# EAGLE design SSM_RGB (EAGLE 8.4.3)
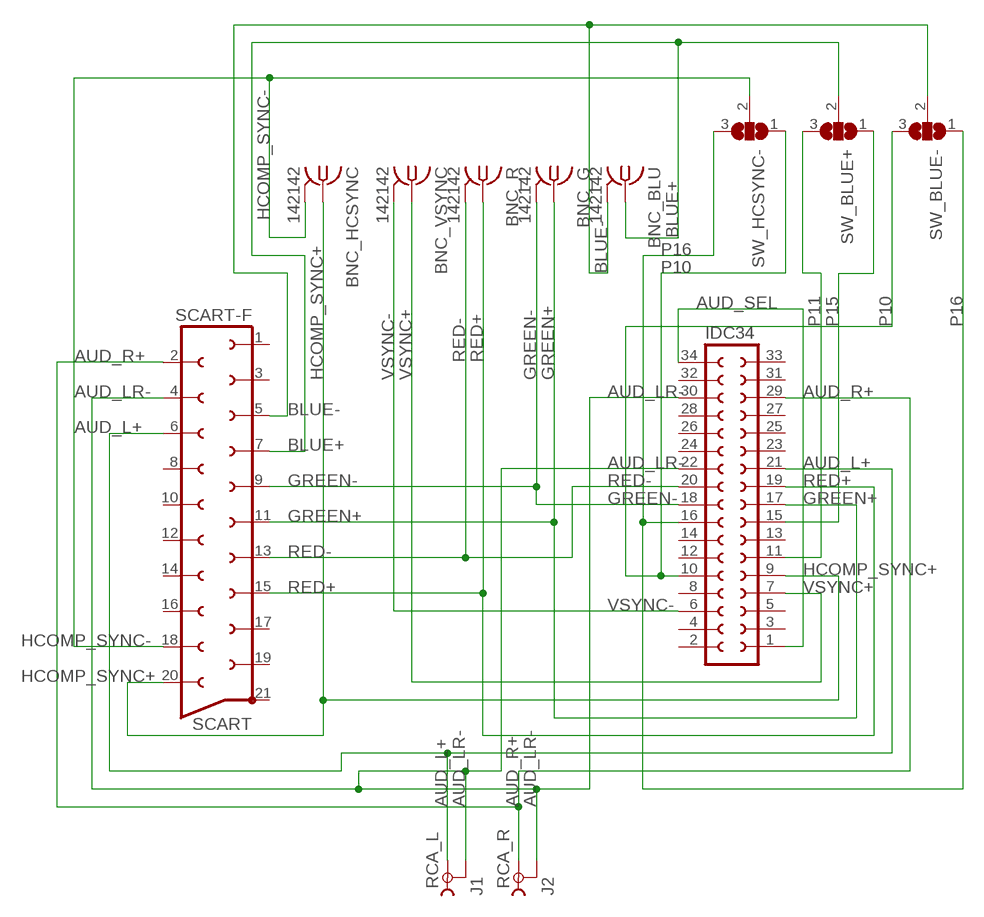
[diagram p0: schematic, sheet 1]

## Parts
BNC_BLU  142142  [142142]
BNC_G  142142  [142142]
BNC_HCSYNC  142142  [142142]
BNC_R  142142  [142142]
BNC_VSYNC  142142  [142142]
IDC34  SOCKET-34RA  [S34RA]
RCA_L  J1  TOBU3  [TOBU3]
RCA_R  J2  TOBU3  [TOBU3]
SCART  SCART-F  [SCART-F]
SW_BLUE+  SJ2W  [SJ_2]
SW_BLUE-  SJ2W  [SJ_2]
SW_HCSYNC-  SJ2W  [SJ_2]

## Nets
AUD_L+: IDC34.21 RCA_L.1 SCART.6
AUD_LR-: IDC34.22 IDC34.30 RCA_L.2 RCA_L.2@1 RCA_L.2@2 RCA_R.2 RCA_R.2@1 RCA_R.2@2 SCART.4
AUD_R+: IDC34.29 RCA_R.1 SCART.2
AUD_SEL: IDC34.1 IDC34.34
BLUE+: BNC_BLU.1 SCART.7 SW_BLUE+.2
BLUE-: BNC_BLU.2 BNC_BLU.3 BNC_BLU.4 BNC_BLU.5 SCART.5 SW_BLUE-.2
GREEN+: BNC_G.1 IDC34.17 SCART.11
GREEN-: BNC_G.2 BNC_G.3 BNC_G.4 BNC_G.5 IDC34.18 SCART.9
HCOMP_SYNC+: BNC_HCSYNC.1 IDC34.9 SCART.20
HCOMP_SYNC-: BNC_HCSYNC.2 BNC_HCSYNC.3 BNC_HCSYNC.4 BNC_HCSYNC.5 SCART.18 SW_HCSYNC-.2
P10: IDC34.10 SW_BLUE-.3 SW_HCSYNC-.1
P11: IDC34.11 SW_BLUE+.3
P15: IDC34.15 SW_BLUE+.1
P16: IDC34.16 SW_BLUE-.1 SW_HCSYNC-.3
RED+: BNC_R.1 IDC34.19 SCART.15
RED-: BNC_R.2 BNC_R.3 BNC_R.4 BNC_R.5 IDC34.20 SCART.13
VSYNC+: BNC_VSYNC.1 IDC34.7
VSYNC-: BNC_VSYNC.2 BNC_VSYNC.3 BNC_VSYNC.4 BNC_VSYNC.5 IDC34.6
Unconnected: IDC34.2 IDC34.3 IDC34.4 IDC34.5 IDC34.8 IDC34.12 IDC34.13 IDC34.14 IDC34.23 IDC34.24 IDC34.25 IDC34.26 IDC34.27 IDC34.28 IDC34.31 IDC34.32 IDC34.33 SCART.1 SCART.3 SCART.8 SCART.10 SCART.12 SCART.14 SCART.16 SCART.17 SCART.19 SCART.21

## Library data of the parts
BNC_BLU BNC_G BNC_R BNC_VSYNC = amphenol-142142_10:142142: Amphenol Connex 142142 SMB R/A P. C. B. Mount Plug Source: http://www.amphenolconnex.com/media/downloads/4323/142142.pdf; MF: Amphenol Connex; MPN: 142142; OC_FARNELL: unknown; OC_NEWARK: unknown
BNC_HCSYNC = amphenol-142142_10:142142: Amphenol Connex 142142 SMB R/A P. C. B. Mount Plug Source: http://www.amphenolconnex.com/media/downloads/4323/142142.pdf; MF: Amphenol Connex; OC_FARNELL: unknown; OC_NEWARK: unknown
IDC34 = con-3m-skt-header:SOCKET-34: 34 pin PCB Socket (3m 85xx/51xx)
RCA_L RCA_R = con-hirschmann:TOBU3: Female Cinch CONNECTOR ( RCA Jack ); MF: FARNELL; MPN: TOBU 3; OC_FARNELL: 592791; OC_NEWARK: 06WX5914
SCART = con-hirschmann:SCART-F: TV SCART CONNECTOR; OC_FARNELL: unknown; OC_NEWARK: unknown
SW_BLUE+ SW_BLUE- SW_HCSYNC- = jumper:SJ2W: SMD solder JUMPER

## Board
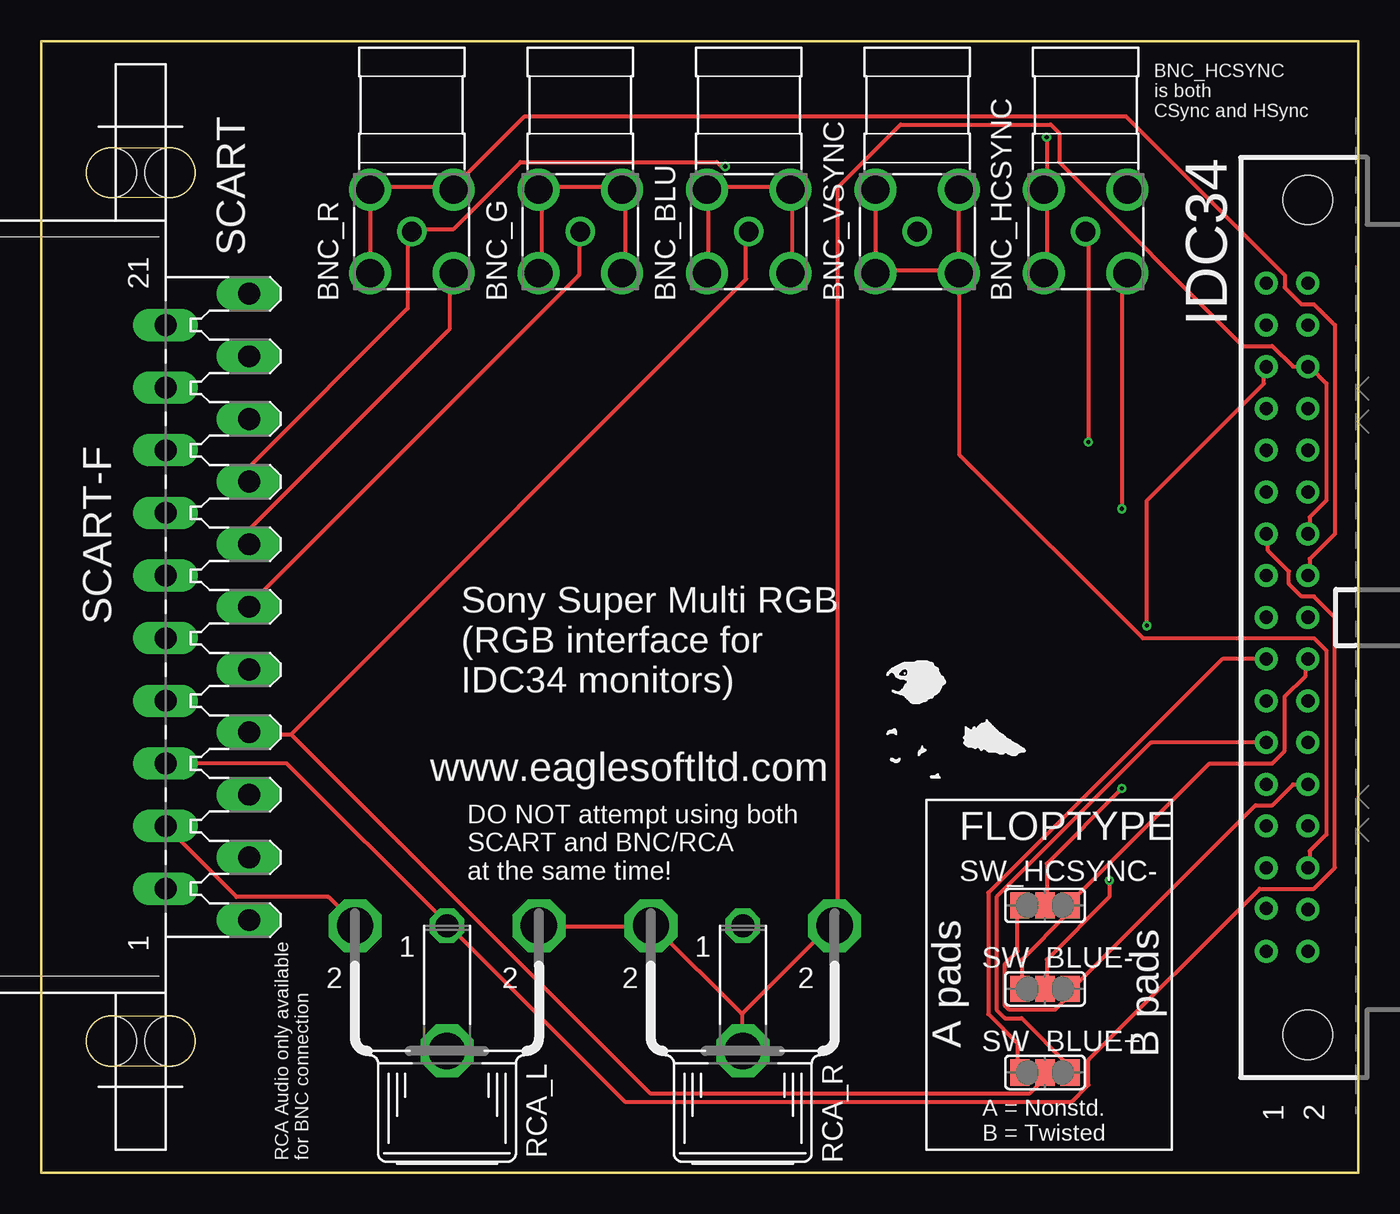
[diagram p1: board, top side]
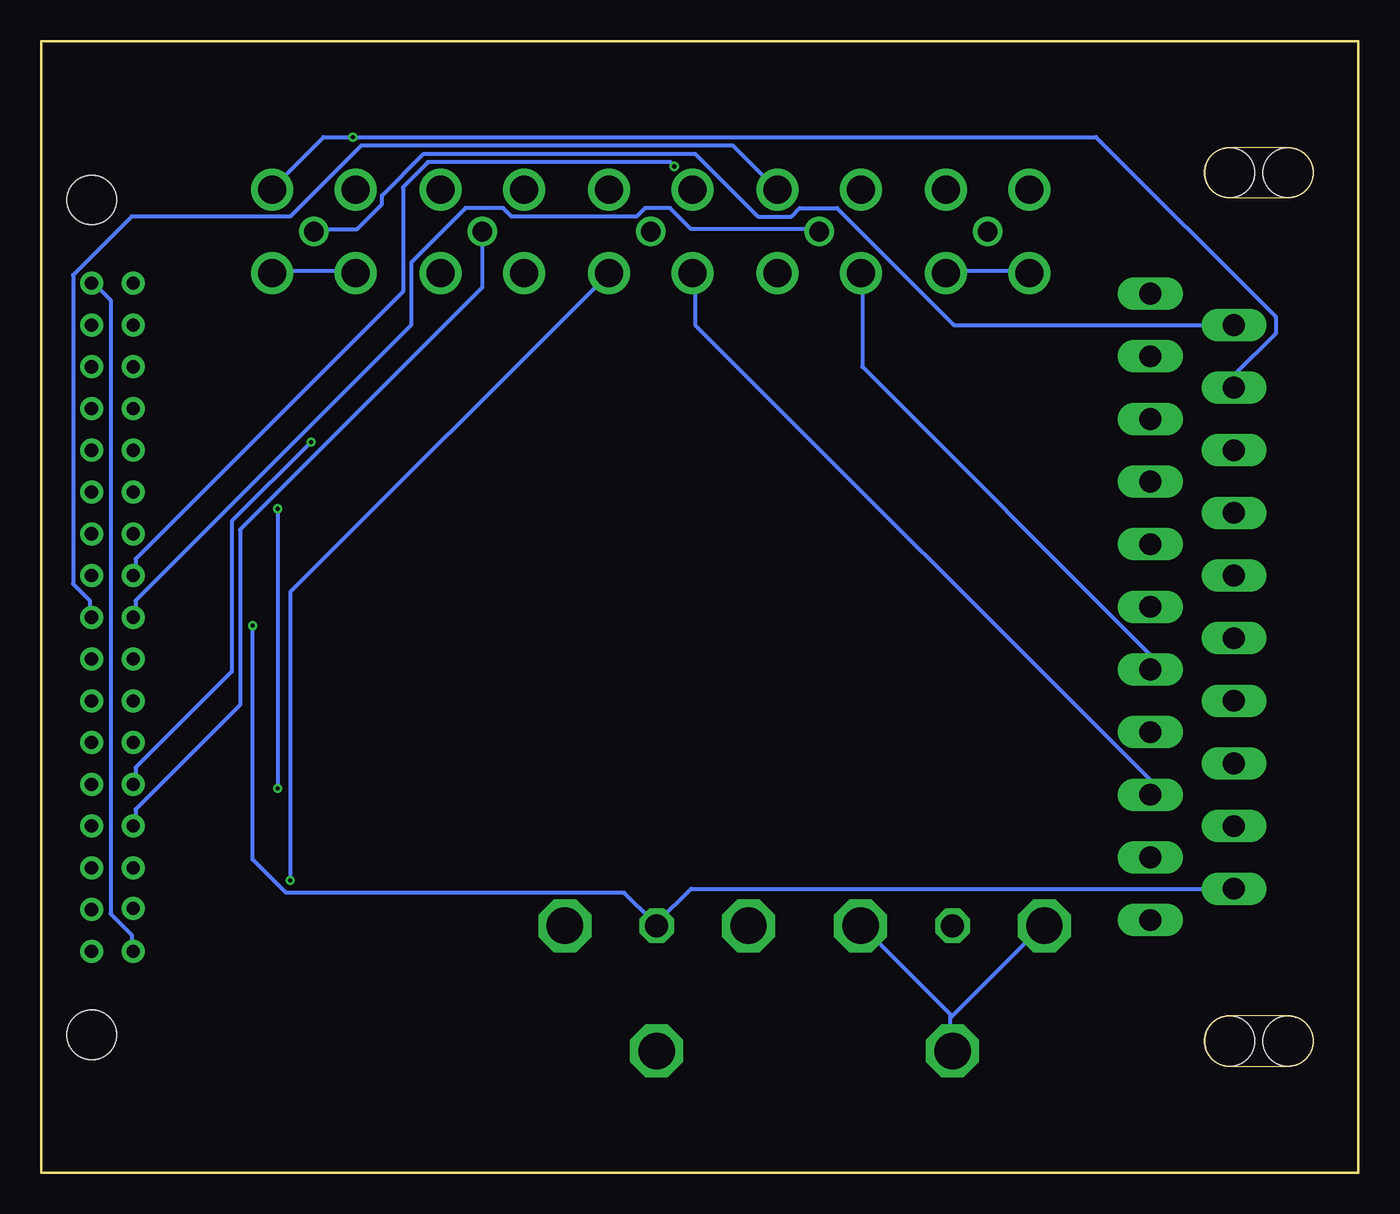
[diagram p2: board, bottom side, seen from below]

Size 80.13 x 68.83 mm. Coordinates in mm from the lower left corner, seen from the top.
Outline: 80.13,68.83 80.13,0 0,0 0,68.83 80.13,68.83
Copper layers (1*16): Top 0.035559375mm / dielectric 1.6mm / Bottom 0.035559375mm
Design rules "oshpark-2layer-auto-routing": minimum track width 10mil, minimum drill 10mil, track to track 10mil, track to pad 8mil, pad to pad 8mil, via to via 8mil, smd to smd 6mil, copper to edge 15mil, drill to drill 6mil, minimum pad ring 6mil, minimum via ring 6mil, stop-mask expansion 2.5mil, vias tented up to drill 0mil, thermal gap 10mil

### Footprints (pad centres in the part's own frame; a part is rotated, then mirrored left to right if it is on the bottom)
142142 = drill 1.2: 1 0,0 | drill 1.7: 2 -2.54,2.54; 3 2.54,2.54; 4 2.54,-2.54; 5 -2.54,-2.54
S34RA = drill 0.8 pad 1.4: 1 20.32,-5.44; 2 20.32,-2.9; 3 17.7,-5.44; 4 17.78,-2.9; 5 15.24,-5.44; 6 15.24,-2.9; 7 12.7,-5.44; 8 12.7,-2.9; 9 10.16,-5.44; 10 10.16,-2.9; 11 7.62,-5.44; 12 7.62,-2.9; 13 5.08,-5.44; 14 5.08,-2.9; 15 2.54,-5.44; 16 2.54,-2.9; 17 0,-5.44; 18 0,-2.9; 19 -2.54,-5.44; 20 -2.54,-2.9; 21 -5.08,-5.44; 22 -5.08,-2.9; 23 -7.62,-5.44; 24 -7.62,-2.9; 25 -10.16,-5.44; 26 -10.16,-2.9; 27 -12.7,-5.44; 28 -12.7,-2.9; 29 -15.24,-5.44; 30 -15.24,-2.9; 31 -17.78,-5.44; 32 -17.78,-2.9; 33 -20.32,-5.44; 34 -20.32,-2.9 | hole 3: -25.39,-2.9; 25.39,-2.9
TOBU3 = drill 1.397 octagon: 1 0,-2.54 | drill 2.21 octagon: 2 5.588,-2.54; 2@1 -5.588,-2.54; 2@2 0,5.08
SCART-F = drill 1.321 long: 1 19.05,5.08; 2 17.145,0; 3 15.24,5.08; 4 13.335,0; 5 11.43,5.08; 6 9.525,0; 7 7.62,5.08; 8 5.715,0; 9 3.81,5.08; 10 1.905,0; 11 0,5.08; 12 -1.905,0; 13 -3.81,5.08; 14 -5.715,0; 15 -7.62,5.08; 16 -9.525,0; 17 -11.43,5.08; 18 -13.335,0; 19 -15.24,5.08; 20 -17.145,0; 21 -19.05,5.08 | hole 3.023: 26.416,0.254; 26.416,-3.302; -26.416,0.254; -26.416,-3.302
SJ_2 = smd 1.168 x 1.6: 1 -1.524,0; 2 0,0; 3 1.524,0

### Placement (x,y rotation side)
BNC_BLU  43.05,57.25 90 top
BNC_G  32.8,57.25 90 top
BNC_HCSYNC  63.54,57.25 90 top
BNC_R  22.55,57.25 90 top
BNC_VSYNC  53.3,57.25 90 top
IDC34  79.97,33.78 270 top
RCA_L  24.69,12.48 180 top
RCA_R  42.68,12.48 180 top
SCART  7.58,34.42 270 top
SW_BLUE+  61.07,6.1 0 top
SW_BLUE-  61.07,11.18 0 top
SW_HCSYNC-  61.07,16.26 0 top

### Tracks (layer width: path | path; a pad name or v marks a point on that pad's centre or on a via)
AUD_L+
  Top 0.254: IDC34.21 74.63,38.86 74.63,37.85 75.9,36.58 75.9,35.81 76.66,35.05 77.43,35.05 78.7,33.78 78.7,18.54 77.43,17.27 74.12,17.27 63.71,6.86 63.71,5.33 62.69,4.32 35.52,4.32 24.85,14.99 RCA_L.1 24.59,15.24 14.94,24.89 SCART.6
AUD_LR-
  Top 0.254: SCART.4 11.89,16.76 17.48,16.76 19.01,15.24 RCA_L.2 | RCA_L.2@1 30.44,14.99 37.04,14.99 RCA_R.2 37.29,14.99 42.63,9.65 | 42.63,9.65 42.63,7.62 RCA_R.2@2 | IDC34.22 77.17,38.86 77.17,39.88 78.19,40.89 78.19,48.01 77.17,49.02 IDC34.30 76.16,49.02 74.89,50.29 73.11,50.29 61.93,61.47 61.93,63.25 61.42,63.75 52.28,63.75 48.47,59.94 48.47,15.24 RCA_R.2@1 48.22,15.24 42.63,9.65
  Bottom 0.254: 24.85,9.4 24.85,9.65 30.18,14.99 RCA_L.2@1 | 24.85,9.4 24.85,7.62 RCA_L.2@2 | 24.85,9.4 19.26,14.99 RCA_L.2
AUD_R+  (via drill 0.25)
  Top 0.254: v67.27,33.27 67.27,40.89 74.38,48.01 74.38,49.02 IDC34.29
  Bottom 0.254: v67.27,33.27 67.27,19.05 65.23,17.02 44.66,17.02 42.88,15.24 RCA_R.1 42.63,15.24 40.6,17.27 SCART.2
AUD_SEL
  Bottom 0.254: IDC34.1 74.63,13.46 74.63,14.48 75.9,15.75 75.9,53.09 76.92,54.1 IDC34.34
BLUE+
  Top 0.254: 15.2,26.67 37.04,4.83 60.15,4.83 60.92,5.59 60.92,6.1 SW_BLUE+.2 | 15.2,26.67 12.66,26.67 SCART.7 | 15.2,26.67 42.88,54.36 42.88,57.15 BNC_BLU.1
BLUE-  (via drill 0.25)
  Top 0.254: v64.98,17.78 64.98,16.76 61.17,12.95 61.17,11.18 SW_BLUE-.2 | BNC_BLU.2 40.6,54.86 40.6,59.69 BNC_BLU.3 40.6,59.94 45.42,59.94 BNC_BLU.4 45.68,59.69 45.68,54.86 BNC_BLU.5
  Bottom 0.254: v64.98,17.78 64.98,35.31 45.68,54.61 BNC_BLU.5 | SCART.5 12.66,23.88 40.34,51.56 40.34,54.61 BNC_BLU.2
GREEN+
  Top 0.254: SCART.11 12.66,34.54 32.72,54.61 32.72,57.15 BNC_G.1
  Bottom 0.254: IDC34.17 74.38,33.78 74.38,34.8 57.61,51.56 57.61,55.37 54.31,58.67 52.03,58.67 51.52,58.17 43.9,58.17 43.39,58.67 41.87,58.67 40.6,57.4 32.98,57.4 BNC_G.1
GREEN-
  Top 0.254: BNC_G.5 35.52,54.86 35.52,59.69 BNC_G.4 35.26,59.94 30.44,59.94 BNC_G.3 30.44,59.69 30.44,54.86 BNC_G.2
  Bottom 0.254: SCART.9 12.66,31.5 30.18,49.02 30.18,54.61 BNC_G.2 | IDC34.18 77.17,33.78 77.17,34.8 78.19,35.81 78.19,54.61 74.63,58.17 64.98,58.17 60.66,62.48 38.06,62.48 35.52,59.94 BNC_G.4
HCOMP_SYNC+  (via drill 0.25)
  Top 0.254: v63.71,44.45 63.71,57.15 BNC_HCSYNC.1
  Bottom 0.254: v63.71,44.45 68.54,39.62 68.54,30.48 74.38,24.64 74.38,23.62 IDC34.9 | SCART.20 24.59,51.56 31.71,58.67 33.99,58.67 34.5,58.17 36.53,58.17 40.34,61.98 56.85,61.98 59.39,59.44 59.39,58.93 60.92,57.4 63.46,57.4 BNC_HCSYNC.1
HCOMP_SYNC-  (via drill 0.25)
  Top 0.254: BNC_HCSYNC.2 61.17,54.86 61.17,59.69 BNC_HCSYNC.3 61.17,59.94 v61.17,62.99 | v65.74,23.37 61.17,18.8 61.17,16.26 SW_HCSYNC-.2 | v65.74,40.39 65.74,54.36 66,54.61 BNC_HCSYNC.5
  Bottom 0.254: v65.74,40.39 v65.74,23.37 | BNC_HCSYNC.2 61.17,54.86 66,54.86 BNC_HCSYNC.5 | SCART.18 7.58,48.51 5.04,51.05 5.04,52.07 15.96,62.99 v61.17,62.99 62.95,62.99 66,59.94 BNC_HCSYNC.4
P10
  Top 0.254: SW_HCSYNC-.1 59.39,16.26 59.39,13.46 58.63,12.7 58.63,10.16 58.88,9.91 61.68,9.91 62.44,10.67 62.44,11.18 SW_BLUE-.3 62.69,11.18 73.87,22.35 74.89,22.35 76.16,23.62 IDC34.10
P11
  Top 0.254: IDC34.11 67.52,26.16 58.12,16.76 58.12,9.91 58.63,9.4 59.65,9.4 62.44,6.6 62.44,6.1 SW_BLUE+.3
P15
  Top 0.254: IDC34.15 71.84,31.24 57.61,17.02 57.61,9.65 59.39,7.87 59.39,6.1 SW_BLUE+.1
P16
  Top 0.254: 62.44,16.26 62.44,15.75 59.65,12.95 59.65,11.18 SW_BLUE-.1 | 62.44,16.26 71.08,24.89 74.89,24.89 75.65,25.65 75.65,28.96 76.92,30.23 76.92,31.24 IDC34.16 | 62.44,16.26 SW_HCSYNC-.3
RED+  (via drill 0.25)
  Top 0.254: v41.61,61.21 41.36,61.21 41.1,61.47 29.17,61.47 25.1,57.4 22.56,57.4 BNC_R.1 22.31,57.15 22.31,52.58 12.66,42.93 SCART.15
  Bottom 0.254: v41.61,61.21 41.87,61.47 56.6,61.47 58.12,59.94 58.12,53.59 74.38,37.34 74.38,36.32 IDC34.19
RED-
  Top 0.254: BNC_R.2 20.02,54.86 20.02,59.69 BNC_R.3 20.02,59.94 24.85,59.94 BNC_R.4 25.1,59.94 29.42,64.26 66,64.26 75.65,54.61 75.65,53.85 76.66,52.83 77.43,52.83 78.7,51.56 78.7,38.86 77.17,37.34 77.17,36.32 IDC34.20 | SCART.13 12.66,39.12 24.85,51.31 24.85,54.61 BNC_R.5
  Bottom 0.254: BNC_R.2 20.02,54.86 24.85,54.86 BNC_R.5
VSYNC+
  Bottom 0.254: BNC_VSYNC.1 53.3,53.85 68.03,39.12 68.03,28.45 74.38,22.1 74.38,21.08 IDC34.7
VSYNC-
  Top 0.254: BNC_VSYNC.3 50.76,54.86 | IDC34.6 77.17,18.54 77.17,19.56 78.19,20.57 78.19,31.75 77.43,32.51 67.01,32.51 55.84,43.69 BNC_VSYNC.5 55.84,54.86 | 55.84,54.86 BNC_VSYNC.4 | 55.84,54.86 50.76,54.86 | 50.76,54.86 BNC_VSYNC.2

### Text on the board
tPlace: BNC_HCSYNC / is both / CSync and HSync | A = Nonstd. / B = Twisted | RCA Audio only available / for BNC connection
tNames: Sony Super Multi RGB / (RGB interface for / IDC34 monitors) | www.eaglesoftltd.com | FLOPTYPE | DO NOT attempt using both / SCART and BNC/RCA / at the same time! | B pads | A pads